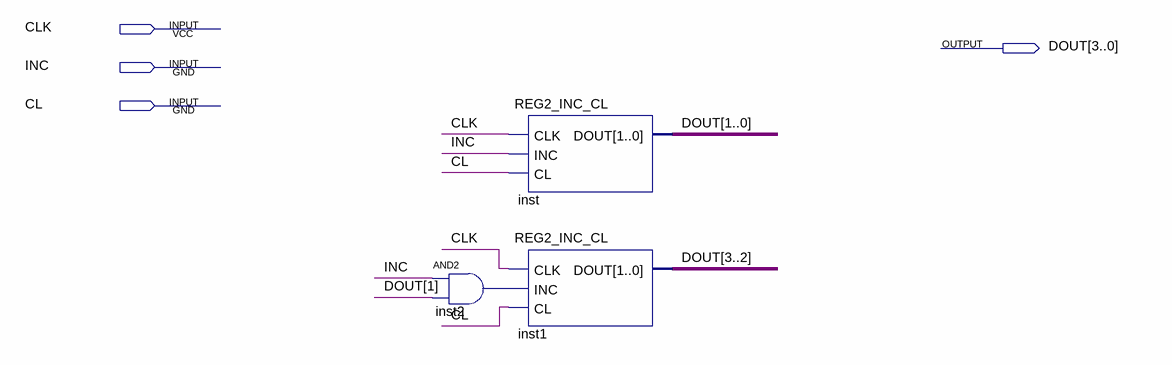
[diagram p0: schematic sheet]
// Quartus schematic REG4_INC_CL.bdf as structural Verilog: 3 symbols, 4 pins
module REG4_INC_CL (
  input  CLK,
  input  INC,
  input  CL,
  output [3:0] DOUT
);

  wire inst2_out;

  and inst2 (inst2_out, INC, DOUT[1]);
  REG2_INC_CL inst (.CLK(CLK), .INC(INC), .CL(CL), .DOUT(DOUT[1:0]));
  REG2_INC_CL inst1 (.CLK(CLK), .INC(inst2_out), .CL(CL), .DOUT(DOUT[3:2]));
endmodule
